# Altium schematic sheet main.SchDoc
size A4; SheetNumber: 1; SheetTotal: 12
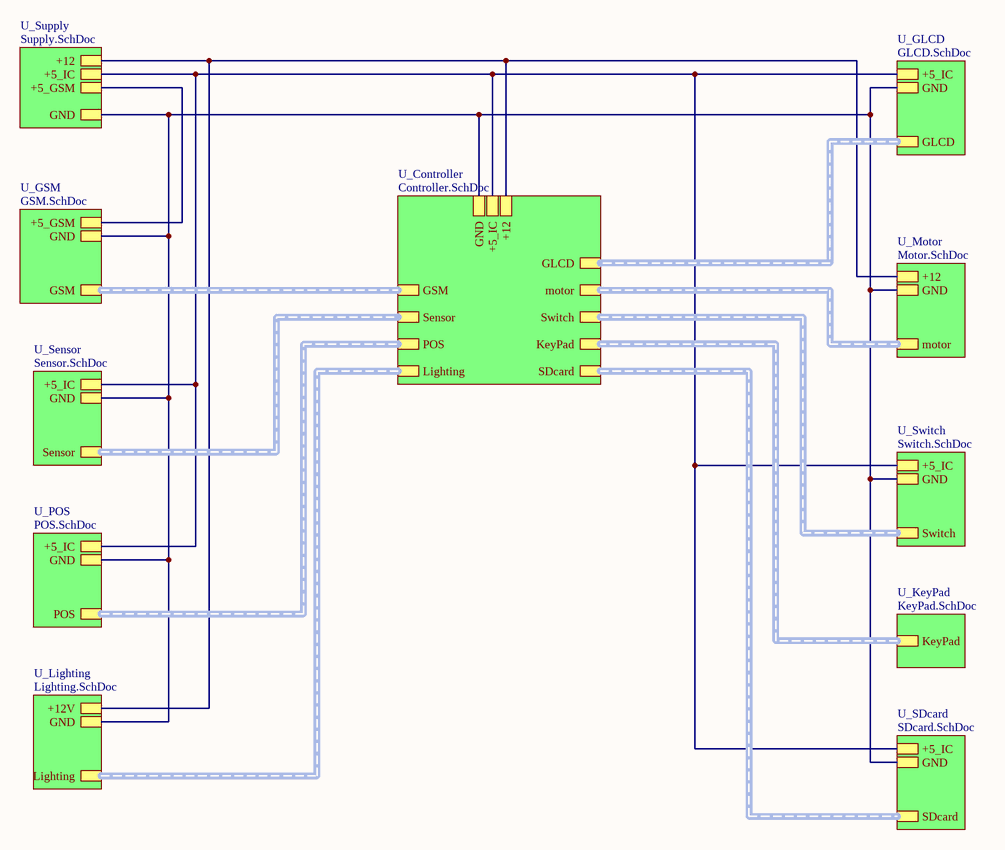
[diagram p0: main.SchDoc]

## Sub-sheets
U_Controller = Controller.SchDoc: GSM (harness GSM), motor (harness motor), Switch (harness Switch), GLCD (harness GLCD), +12, GND, Sensor (harness Sensor), KeyPad (harness KeyPad), SDcard (harness SDcard), Lighting (harness Lighting), POS (harness POS), +5_IC
U_GLCD = GLCD.SchDoc: GLCD (harness GLCD), GND, +5_IC
U_GSM = GSM.SchDoc: GND, GSM (harness GSM), +5_GSM
U_KeyPad = KeyPad.SchDoc: KeyPad (harness KeyPad)
U_Lighting = Lighting.SchDoc: +12V, GND, Lighting (harness Lighting)
U_Motor = Motor.SchDoc: motor (harness motor), +12, GND
U_POS = POS.SchDoc: POS (harness POS), GND, +5_IC
U_SDcard = SDcard.SchDoc: GND, SDcard (harness SDcard), +5_IC
U_Sensor = Sensor.SchDoc: GND, Sensor (harness Sensor), +5_IC
U_Supply = Supply.SchDoc: GND, +12, +5_GSM, +5_IC
U_Switch = Switch.SchDoc: GND, Switch (harness Switch), +5_IC

## Nets
(unnamed): sheet U_GLCD/GND, sheet U_Controller/GND, sheet U_GSM/GND, sheet U_Motor/GND, sheet U_POS/GND, sheet U_Sensor/GND, sheet U_Supply/GND, sheet U_Switch/GND, sheet U_SDcard/GND, sheet U_Lighting/GND
(unnamed): sheet U_GLCD/+5_IC, sheet U_Controller/+5_IC, sheet U_POS/+5_IC, sheet U_Sensor/+5_IC, sheet U_Supply/+5_IC, sheet U_Switch/+5_IC, sheet U_SDcard/+5_IC
(unnamed): sheet U_Controller/+12, sheet U_Motor/+12, sheet U_Supply/+12, sheet U_Lighting/+12V
(unnamed): sheet U_GSM/+5_GSM, sheet U_Supply/+5_GSM

## Buses and harness runs
harness sheet U_Controller/GLCD = sheet U_GLCD/GLCD
harness sheet U_Controller/GSM = sheet U_GSM/GSM
harness sheet U_Controller/KeyPad = sheet U_KeyPad/KeyPad
harness sheet U_Controller/Lighting = sheet U_Lighting/Lighting
harness sheet U_Controller/motor = sheet U_Motor/motor
harness sheet U_Controller/POS = sheet U_POS/POS
harness sheet U_Controller/SDcard = sheet U_SDcard/SDcard
harness sheet U_Controller/Sensor = sheet U_Sensor/Sensor
harness sheet U_Controller/Switch = sheet U_Switch/Switch